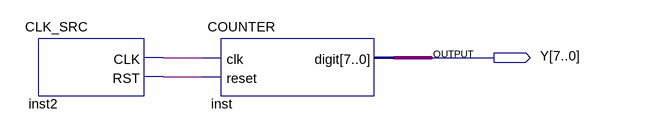
[diagram p0: schematic sheet]
// Quartus schematic sg.bdf as structural Verilog: 2 symbols, 1 pins
module sg (
  output [7:0] Y
);

  wire inst2_clk, inst2_rst;

  CLK_SRC inst2 (.CLK(inst2_clk), .RST(inst2_rst));
  COUNTER inst (.clk(inst2_clk), .reset(inst2_rst), .digit(Y));
endmodule
